# EAGLE design BLEKit v1.2 (EAGLE 7.6.0)
DOCUMENT_NUMBER: 123
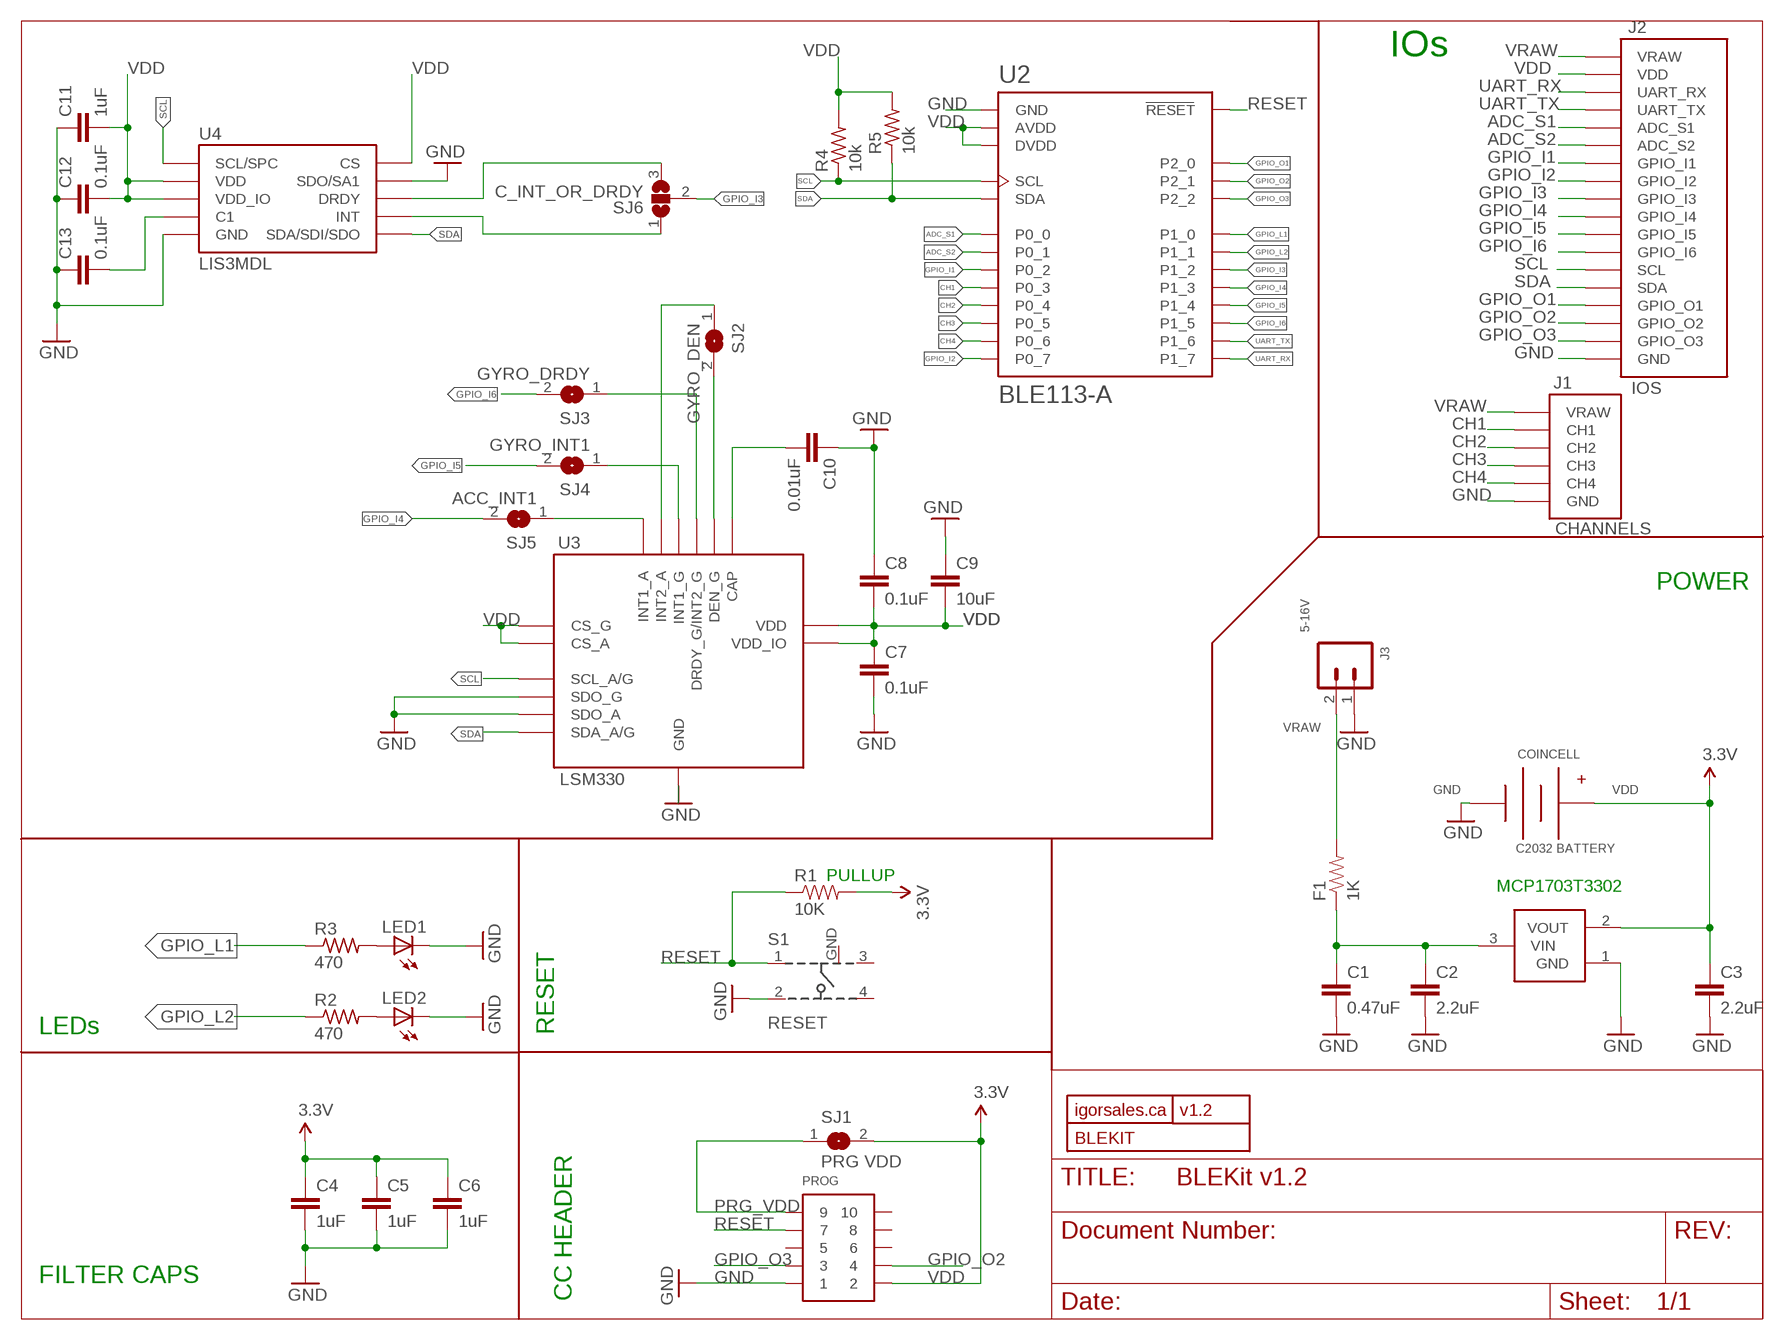
[diagram p0: schematic, sheet 1]

## Parts
BLEKIT  v1.2  IGORSALES_LOGO  [IGORSALES_LOGO]
C1  0.47uF  CAP0603-CAP  [0603-CAP]
C2  2.2uF  CAP0603-CAP  [0603-CAP]
C3  2.2uF  CAP0603-CAP  [0603-CAP]
C4  1uF  CAP0603-CAP  [0603-CAP]
C5  1uF  CAP0603-CAP  [0603-CAP]
C6  1uF  CAP0603-CAP  [0603-CAP]
C7  0.1uF  CAP0603-CAP  [0603-CAP]
C8  0.1uF  CAP0603-CAP  [0603-CAP]
C9  10uF  CAP0603-CAP  [0603-CAP]
C10  0.01uF  CC0402  [C0402]
C11  1uF  CAP0603-CAP  [0603-CAP]
C12  0.1uF  CAP0603-CAP  [0603-CAP]
C13  0.1uF  CAP0603-CAP  [0603-CAP]
COINCELL  C2032 BATTERY  BK-912-TR  [BK-912]
F1  1K  RESISTOR0805-RES  [0805]
J1  CHANNELS  RCTRL_CONNECTOR_CHANNELSRCTRL_CHANNELS_MINI  [HEADER3X4-2.54MM]
J2  IOS  RCTRL_CONNECTOR_IOS-2X9  [HEADER2X9-254MM]
J3  5-16V  CON-S2B-PH-SM4-TB  [S2B-PH-SM4-TB]
LED1  LEDCHIPLED_0805  [CHIPLED_0805]
LED2  LEDCHIPLED_0805  [CHIPLED_0805]
PROG  CONN_5-2-FTSH-V  [FTSH-105-DV]
R1  10K  RESISTOR0603-RES  [0603-RES]
R2  470  R-US_R0603  [R0603]
R3  470  R-US_R0603  [R0603]
R4  10k  R-US_R0402  [R0402]
R5  10k  R-US_R0402  [R0402]
S1  RESET  101-IG  [101-IG]
SJ1  PRG VDD  SJ  [SJ]
SJ2  GYRO_DEN  SJ  [SJ]
SJ3  GYRO_DRDY  SJ  [SJ]
SJ4  GYRO_INT1  SJ  [SJ]
SJ5  ACC_INT1  SJ  [SJ]
SJ6  C_INT_OR_DRDY  SJ2W  [SJ_2]
U1  MCP1703  MCP1703-SOT-23A  [SOT-23A]
U2  BLE113-A  [BLE113-A]
U3  LSM330  [LGA-24-3.5X3X1MM]
U4  LIS3MDL  [VFLGA-2X2X1-12LD]

## Nets
ADC_S1: J2.7(ADC_S1) U2.P0_0
ADC_S2: J2.16(ADC_S2) U2.P0_1
CH1: J1.9(CH1) U2.P0_3
CH2: J1.10(CH2) U2.P0_4
CH3: J1.11(CH3) U2.P0_5
CH4: J1.12(CH4) U2.P0_6
GND [power]: C1.2 C2.2 C3.2 C4.2 C5.2 C6.2 C7.2 C8.1 C9.1 C10.1 C11.1 C12.1 C13.1 COINCELL.BATT-(-) J1.1(GND) J1.2(GND) J1.3(GND) J1.4(GND) J2.1(GND) J3.1 LED1.C LED2.C PROG.1 S1.2 U1.1(GND) U2.GND U2.GND@2(GND) U2.GND@3(GND) U2.GND@4(GND) U2.GND@5(GND) U2.GND@6(GND) U2.GND@7(GND) U2.GND@8(GND) U2.GND@9(GND) U2.GND@10(GND) U3.5(SDO_G) U3.6(SDO_A) U3.14(GND) U3.15(GND) U3.16(GND) U3.17(GND) U3.18(GND) U3.19(GND) U3.20(GND) U4.2(GND) U4.3(GND) U4.9(SDO/SA1) U4.12(GND)
GPIO_I1: J2.4(GPIO_I1) U2.P0_2
GPIO_I2: J2.13(GPIO_I2) U2.P0_7
GPIO_I3: J2.5(GPIO_I3) SJ6.2 U2.P1_2
GPIO_I4: J2.14(GPIO_I4) SJ5.2 U2.P1_3
GPIO_I5: J2.6(GPIO_I5) SJ4.2 U2.P1_4
GPIO_I6: J2.15(GPIO_I6) SJ3.2 U2.P1_5
GPIO_L1: R3.1 U2.P1_0
GPIO_L2: R2.1 U2.P1_1
GPIO_O1: J2.11(GPIO_O1) U2.P2_0
GPIO_O2: J2.3(GPIO_O2) PROG.4 U2.P2_1
GPIO_O3: J2.12(GPIO_O3) PROG.3 U2.P2_2
N$1: LED2.A R2.2
N$2: SJ2.2 U3.13(DEN_G)
N$3: SJ2.1 U3.12(INT2_A)
N$4: LED1.A R3.2
N$5: C10.2 U3.21(CAP)
N$6: C13.2 U4.4(C1)
N$7: SJ5.1 U3.11(INT1_A)
N$8: SJ3.1 U3.9(DRDY_G/INT2_G)
N$9: SJ6.3 U4.8(DRDY)
N$10: SJ4.1 U3.10(INT1_G)
N$13: SJ6.1 U4.7(INT)
PRG_VDD [power]: PROG.9 SJ1.1
RESET: PROG.7 R1.1 S1.1 U2.RESET
SCL: J2.9(SCL) R4.1 U2.SCL U3.2(SCL_A/G) U4.1(SCL/SPC)
SDA: J2.18(SDA) R5.1 U2.SDA U3.4(SDA_A/G) U4.11(SDA/SDI/SDO)
UART_RX: J2.8(UART_RX) U2.P1_7
UART_TX: J2.17(UART_TX) U2.P1_6
VDD [power]: C3.1 C4.1 C5.1 C6.1 C7.1 C8.2 C9.2 C11.2 C12.2 COINCELL.BATT+(+) COINCELL.BATT+@2(+) J2.2(VDD) PROG.2 R1.2 R4.2 R5.2 SJ1.2 U1.2(VOUT) U2.AVDD U2.DVDD U3.1(VDD_IO) U3.3(VDD_IO) U3.7(CS_G) U3.8(CS_A) U3.22(VDD) U3.23(VDD) U3.24(VDD) U4.5(VDD) U4.6(VDD_IO) U4.10(CS) ; supply symbol labelled 3.3V
VRAW: F1.2 J1.5(VRAW) J1.6(VRAW) J1.7(VRAW) J1.8(VRAW) J2.10(VRAW) J3.2
VRAW_FILTERED [power]: C1.1 C2.1 F1.1 U1.3(VIN)
Unconnected: J3.MNT$1 J3.MNT$2 PROG.5 PROG.6 PROG.8 PROG.10 S1.3 S1.4

## Notes on the sheet
- IOs
- POWER
- PULLUP
- MCP1703T3302
- LEDs | RESET
- FILTER CAPS
- CC HEADER

## Power pins joined to a net without a drawn wire
GND: S1.GND

## Library data of the parts
BLEKIT = igorsales:IGORSALES_LOGO: igorsales.ca logo
C1 = SparkFun:CAP: Capacitor Standard 0603 ceramic capacitor, and 0.1" leaded capacitor.; MOUSER#: 81-GRM188R60J474KA01; MPN: GRM188R60J474KA01
C2 C3 = SparkFun:CAP: Capacitor Standard 0603 ceramic capacitor, and 0.1" leaded capacitor.; MOUSER#: 81-GRM188R61A225KE4J; MPN: GRM188R61A225KE4J
C4-C6 C11 = SparkFun:CAP: Capacitor Standard 0603 ceramic capacitor, and 0.1" leaded capacitor.; MOUSER#: 81-GRM188R61C105KA3J; MPN: GRM188R61C105KA93J
C7 C8 C12 C13 = SparkFun:CAP: Capacitor Standard 0603 ceramic capacitor, and 0.1" leaded capacitor.; MOUSER#: 81-GRM39X104K16; MPN: GRM188R71C104KA01D
C9 = SparkFun:CAP: Capacitor Standard 0603 ceramic capacitor, and 0.1" leaded capacitor.; MOUSER#: 963-EMK107BBJ106MA-T; MPN: EMK107BBJ106MA-T
C10 = eagle-ltspice:C: CAPACITOR, European symbol; MOUSER#: 81-GRM36X103K25; MPN: GRM155R71E103KA01D; SPICEMODEL: NONE; SPICEPREFIX: C; VOLTAGE: 25V
COINCELL = igorsales:BK-912-TR: Coin Cell Battery Holder, bottom surface mouted for C2032 batteries; DIGI-KEY#: BK-912-ND; MPN: BK-912
F1 = SparkFun:RESISTOR: Resistor Basic schematic elements and footprints for 0603, 1206, and PTH resistors.; MOUSER#: 810-MMZ2012R102A; MPN: MMZ2012R102A
J1 = igorsales:RCTRL_CONNECTOR_CHANNELS: Header to connect pins. 2.54MM pitch, with 5mm exposed lead upwards.; DIGI-KEY#: TSW-104-07-T-T-ND; MPN: TSW-104-07-T-T
J2 = igorsales:RCTRL_CONNECTOR_IOS: RCTRL's 3X6 HEADER with 2.54mm pitch and 5mm lead size; MOUSER#: 649-77313-401-18LF; MPN: 77313-401-18LF
J3 = PowerBoard:CON-S2B-PH-SM4-TB: JST connector (vertical) 2-pin vertical JST connector with SMT Source: http://www.jst-mfg.com/product/pdf/eng/ePH.pdf; CONNECTOR-TYPE: Header, shrouded; CONTACT-TYPE: Male pin; DIGI-KEY#: 455-1749-1-ND; MF: JST; MPN: S2B-PH-SM4-TB(LF)(SN)
LED1 = led:LED: LED OSRAM: - CHIPLED LG R971, LG N971, LY N971, LG Q971, LY Q971, LO R971, LY R971 LH N974, LH R974 LS Q976, LO Q976, LY Q976 LO Q996 - Hyper CHIPLED LW Q18S LB Q993, LB Q99A, LB R99A - SideLED LS A670, LO A670, LY A670, LG A670, LP A670 LB A673, LV A673, LT A673, LW A673 LH A674 LY A675 LS A676, LA A676, LO A676, LY A676, LW A676 LS A679, LY A679, LG A679 - Hyper Micro SIDELED® LS Y876, LA Y876, LO Y876, LY Y876 LT Y87S - SmartLED LW L88C, LW L88S LB L89C, LB L89S, LG L890 LS L89K, LO L89K, LY L89K LS L896, LA L896, LO L896, LY L896 - TOPLED LS T670, LO T670, LY T670, LG T670, LP T670 LSG T670, LSP T670, LSY T670, LOP T670, LYG T670 LG T671, LOG T671, LSG T671 LB T673, LV T673, LT T673, LW T673 LH T674 LS T676, LA T676, LO T676, LY T676, LB T676, LH T676, LSB T676, LW T676 LB T67C, LV T67C, LT T67C, LS T67K, LO T67K, LY T67K, LW E67C LS E67B, LA E67B, LO E67B, LY E67B, LB E67C, LV E67C, LT E67C LW T67C LS T679, LY T679, LG T679 LS T770, LO T770, LY T770, LG T770, LP T770 LB T773, LV T773, LT T773, LW T773 LH T774 LS E675, LA E675, LY E675, LS T675 LS T776, LA T776, LO T776, LY T776, LB T776 LHGB T686 LT T68C, LB T68C - Hyper Mini TOPLED® LB M676 - Mini TOPLED Santana® LG M470 LS M47K, LO M47K, LY M47K Source: http://www.osram.convergy.de LUXEON: - LUMILED® LXK2-PW12-R00, LXK2-PW12-S00, LXK2-PW14-U00, LXK2-PW14-V00 LXK2-PM12-R00, LXK2-PM12-S00, LXK2-PM14-U00 LXK2-PE12-Q00, LXK2-PE12-R00, LXK2-PE12-S00, LXK2-PE14-T00, LXK2-PE14-U00 LXK2-PB12-K00, LXK2-PB12-L00, LXK2-PB12-M00, LXK2-PB14-N00, LXK2-PB14-P00, LXK2-PB14-Q00 LXK2-PR12-L00, LXK2-PR12-M00, LXK2-PR14-Q00, LXK2-PR14-R00 LXK2-PD12-Q00, LXK2-PD12-R00, LXK2-PD12-S00 LXK2-PH12-R00, LXK2-PH12-S00 LXK2-PL12-P00, LXK2-PL12-Q00, LXK2-PL12-R00 Source: www.luxeon.com KINGBRIGHT: KA-3528ASYC Source: www.kingbright.com; MOUSER#: 638-1721SYGCS530E2; MPN: 1721SYGCS530E2
LED2 = led:LED: LED OSRAM: - CHIPLED LG R971, LG N971, LY N971, LG Q971, LY Q971, LO R971, LY R971 LH N974, LH R974 LS Q976, LO Q976, LY Q976 LO Q996 - Hyper CHIPLED LW Q18S LB Q993, LB Q99A, LB R99A - SideLED LS A670, LO A670, LY A670, LG A670, LP A670 LB A673, LV A673, LT A673, LW A673 LH A674 LY A675 LS A676, LA A676, LO A676, LY A676, LW A676 LS A679, LY A679, LG A679 - Hyper Micro SIDELED® LS Y876, LA Y876, LO Y876, LY Y876 LT Y87S - SmartLED LW L88C, LW L88S LB L89C, LB L89S, LG L890 LS L89K, LO L89K, LY L89K LS L896, LA L896, LO L896, LY L896 - TOPLED LS T670, LO T670, LY T670, LG T670, LP T670 LSG T670, LSP T670, LSY T670, LOP T670, LYG T670 LG T671, LOG T671, LSG T671 LB T673, LV T673, LT T673, LW T673 LH T674 LS T676, LA T676, LO T676, LY T676, LB T676, LH T676, LSB T676, LW T676 LB T67C, LV T67C, LT T67C, LS T67K, LO T67K, LY T67K, LW E67C LS E67B, LA E67B, LO E67B, LY E67B, LB E67C, LV E67C, LT E67C LW T67C LS T679, LY T679, LG T679 LS T770, LO T770, LY T770, LG T770, LP T770 LB T773, LV T773, LT T773, LW T773 LH T774 LS E675, LA E675, LY E675, LS T675 LS T776, LA T776, LO T776, LY T776, LB T776 LHGB T686 LT T68C, LB T68C - Hyper Mini TOPLED® LB M676 - Mini TOPLED Santana® LG M470 LS M47K, LO M47K, LY M47K Source: http://www.osram.convergy.de LUXEON: - LUMILED® LXK2-PW12-R00, LXK2-PW12-S00, LXK2-PW14-U00, LXK2-PW14-V00 LXK2-PM12-R00, LXK2-PM12-S00, LXK2-PM14-U00 LXK2-PE12-Q00, LXK2-PE12-R00, LXK2-PE12-S00, LXK2-PE14-T00, LXK2-PE14-U00 LXK2-PB12-K00, LXK2-PB12-L00, LXK2-PB12-M00, LXK2-PB14-N00, LXK2-PB14-P00, LXK2-PB14-Q00 LXK2-PR12-L00, LXK2-PR12-M00, LXK2-PR14-Q00, LXK2-PR14-R00 LXK2-PD12-Q00, LXK2-PD12-R00, LXK2-PD12-S00 LXK2-PH12-R00, LXK2-PH12-S00 LXK2-PL12-P00, LXK2-PL12-Q00, LXK2-PL12-R00 Source: www.luxeon.com KINGBRIGHT: KA-3528ASYC Source: www.kingbright.com; MOUSER#: 638-172BHC-AN1P23T; MPN: 172BHC-AN1P23T
PROG = pel_misc:CONN_5-2; DIGI-KEY#: FTSH-105-02-F-DV-ND; MOUSER#: 649-202112100010C4LF; MPN: FTSH-105-02-F-DV
R1 = SparkFun:RESISTOR: Resistor Basic schematic elements and footprints for 0603, 1206, and PTH resistors.; MOUSER#: 603-AF0603FR-0710KL; MPN: AF0603FR-0710KL
R2 R3 = resistor:R-US_: RESISTOR, American symbol; MOUSER#: 667-ERJ-3EKF4700V; MPN: ERJ-3EKF4700V
R4 R5 = rcl:R-US_: RESISTOR, American symbol; MOUSER#: 603-AF0603FR-0710KL; MPN: AF0603FR-0710KL; POWER: 0.063W; VOLTAGE: 50V
S1 = sf-keyglove:101-IG; MOUSER#: 101-IG23K-EV; MPN: 101-IG23K-EV
SJ1-SJ5 = jumper:SJ: SMD solder JUMPER
SJ6 = jumper:SJ2W: SMD solder JUMPER
U1 = igorsales:MCP1703-SOT-23A: MCP1703 SOT-23A; DIGI-KEY#: MCP1703T-3302E/CBCT-ND; MOUSER#: 579-MCP1703T-3302ECB; MPN: MCP1703T-3302E/CB
U2 = sf-bluegiga:BLE113: Bluetooth Low Energy single-mode module - Bluetooth 4.0 (CC2541). BLE113-A variant has an on-module ceramic chip antenna. BLE113-A variant includes keepout/restrict area. Antenna edge of the module should be flush up against the edge of the PCB. See datasheet for variant layout details. The BLE113 is a Bluetooth Smart module targeted for small and low-power sensors and accessories. It integrates all features required for a Bluetooth Smart application, including Bluetooth radio, software stack, and GATT-based profiles. The BLE113 Bluetooth Smart module can also host end-user applications, which means no external micro controller is required in size or price constrained devices. Moreover, it has flexible hardware interfaces to connect to different peripherals and sensors and can be powered directly from a standard 3V coin cell battery or a pair of AAA batteries. In the lowest power sleep mode it merely consumes 500 nA and will wake up within a few hundred microseconds. The BLE113 Bluetooth Smart module conusmer approximately 30% less power and is smaller than the BLE112 Bluetooth Smart Module. http://www.bluegiga.com/en-US/products/bluetooth-4.0-modules/ble113-bluetooth--smart-module https://github.com/jrowberg/sf-oshw Last updated 2014-01-04 by Jeff Rowberg <jeff@rowberg.net>; ANTENNA: On-module ceramic chip antenna; DIGI-KEY#: 1446-1035-1-ND; MOUSER#: 603-BLE113-A-M256K; MPN: BLE113-A-M256K
U3 = igorsales:LSM330: LSM330 http://www.st.com/web/en/resource/technical/document/datasheet/DM00059856.pdf; I2C_ADDR: 0x3C,0xD4; MOUSER#: 511-LSM330TR; MPN: LSM330TR
U4 = igorsales:LIS3MDL: Compass IC http://www.st.com/web/en/resource/technical/document/datasheet/DM00075867.pdf; I2C_ADDR: 0x38; MOUSER#: 511-LIS3MDLTR; MPN: LIS3MDLTR

## Net classes
0 default: width 0.152 mm, drill 0.33 mm, clearance 0.152 mm
1 power: width 0.254 mm, drill 0.33 mm, clearance 0.152 mm

## Board
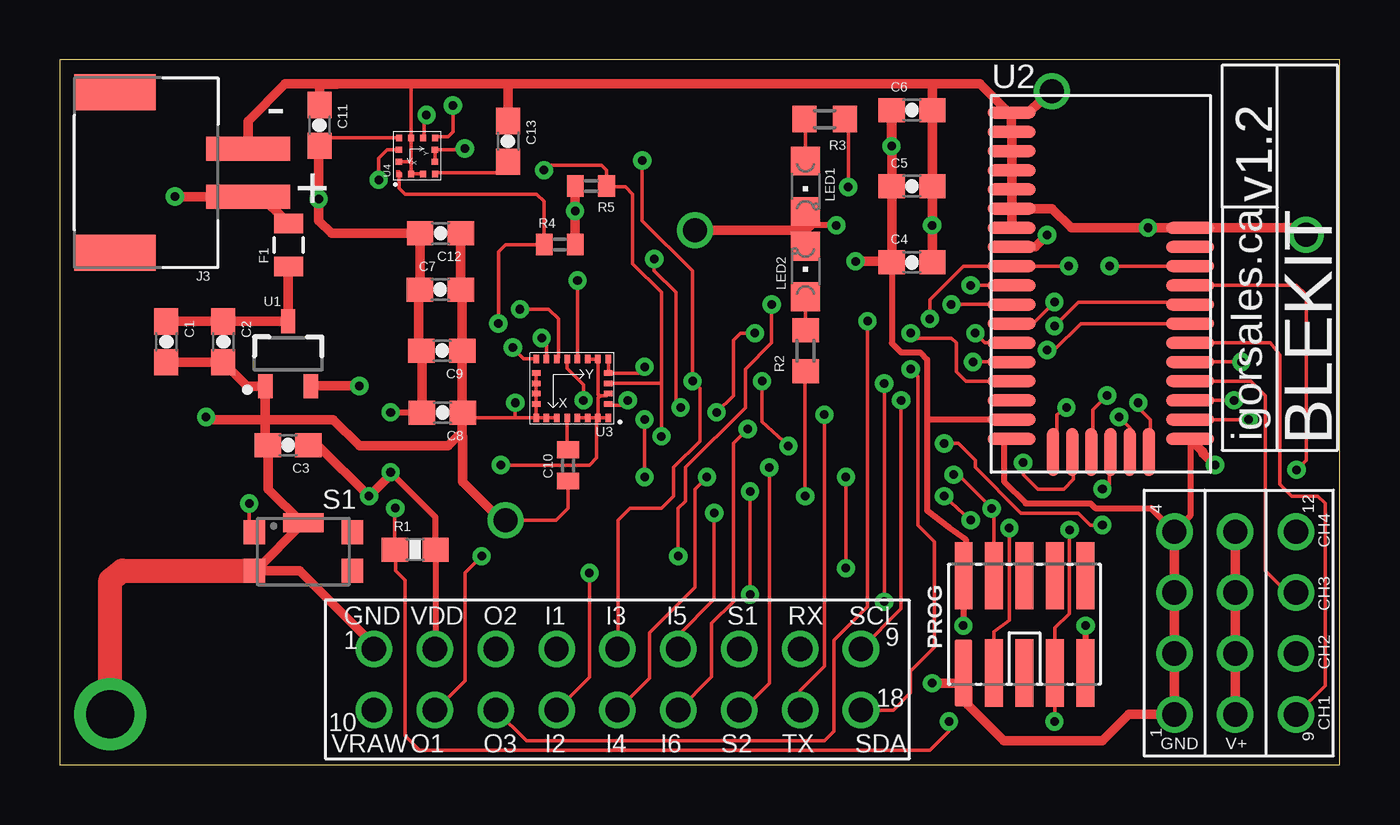
[diagram p1: board, top side]
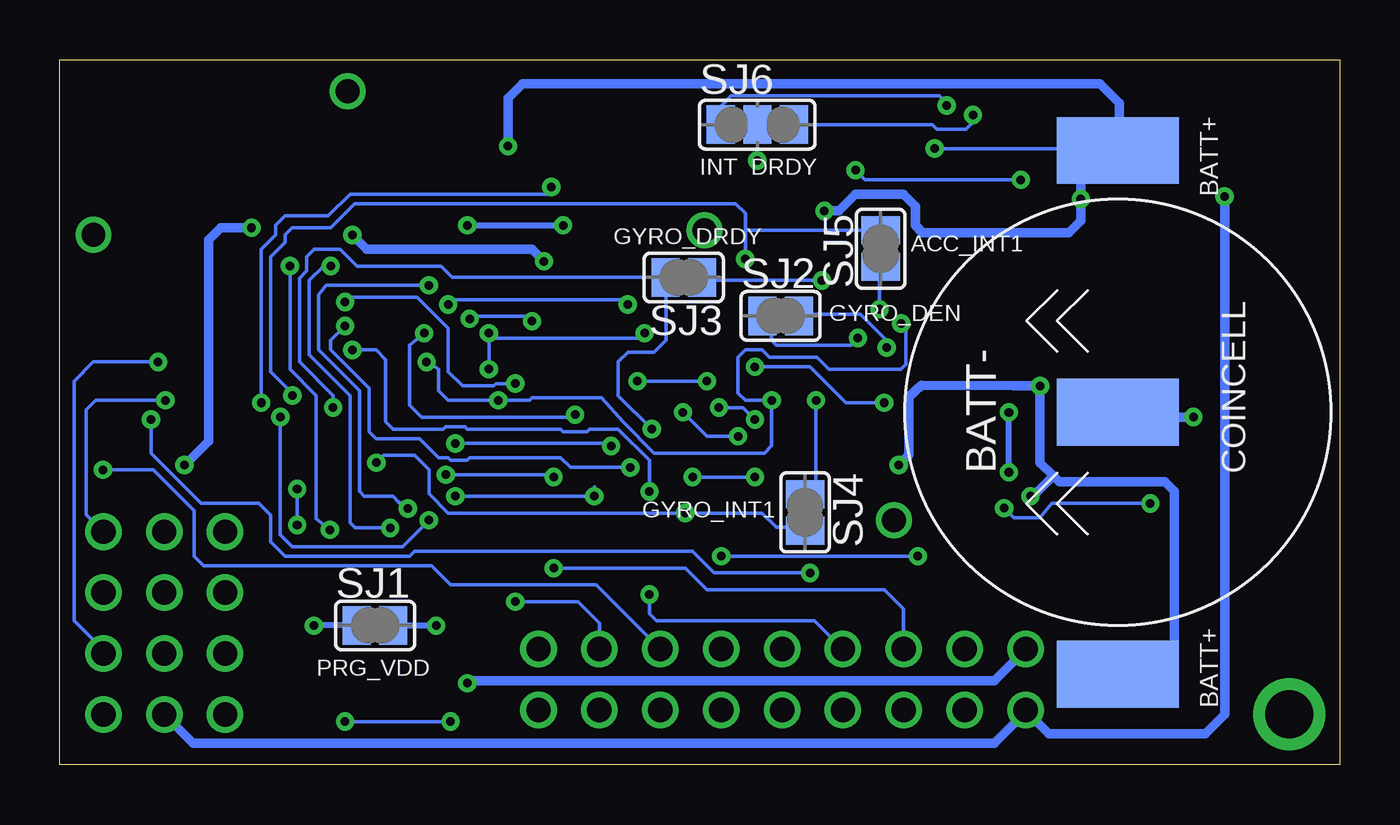
[diagram p2: board, bottom side, seen from below]

Size 53.4 x 29.4 mm. Coordinates in mm from the lower left corner, seen from the top.
Outline: 0,0 53.4,0 53.4,29.4 0,29.4 0,0
Copper layers (1*16): Top 0.0178mm / dielectric 59mil / Bottom 0.0178mm
Design rules "SSC-EAGLE-2Lyr_v1.0.0.3": minimum track width 6mil, minimum drill 14mil, track to track 6mil, track to pad 6mil, pad to pad 6mil, via to via 6mil, smd to smd 6mil, copper to edge 20mil, drill to drill 16mil, minimum pad ring 8mil, minimum via ring 8mil, stop-mask expansion 3mil, vias tented up to drill 0mil, thermal gap 10mil

### Footprints (pad centres in the part's own frame; a part is rotated, then mirrored left to right if it is on the bottom)
0603-CAP = smd 1.1 x 1: 1 -0.85,0; 2 0.85,0
C0402 = smd 0.7 x 0.9: 1 -0.65,0; 2 0.65,0
BK-912 = smd 2.794 x 5.08 bottom: BATT+ -10.922,0; BATT+@2 10.922,0; BATT- 0,0
0805 = smd 0.8 x 1.2: 1 -0.9,0; 2 0.9,0
HEADER3X4-2.54MM = drill 1.016: 1 -3.81,2.54; 2 -1.27,2.54; 3 1.27,2.54; 4 3.81,2.54; 5 -3.81,0; 6 -1.27,0; 7 1.27,0; 8 3.81,0; 9 -3.81,-2.54; 10 -1.27,-2.54; 11 1.27,-2.54; 12 3.81,-2.54
HEADER2X9-254MM = drill 1.016: 1 -10.16,1.27; 2 -7.62,1.27; 3 -5.08,1.27; 4 -2.54,1.27; 5 0,1.27; 6 2.54,1.27; 7 5.08,1.27; 8 7.62,1.27; 9 10.16,1.27; 10 -10.16,-1.27; 11 -7.62,-1.27; 12 -5.08,-1.27; 13 -2.54,-1.27; 14 0,-1.27; 15 2.54,-1.27; 16 5.08,-1.27; 17 7.62,-1.27; 18 10.16,-1.27
S2B-PH-SM4-TB = smd 1 x 3.5: 1 1,-2.75; 2 -1,-2.75 | smd 1.5 x 3.4: MNT$1 3.35,2.8; MNT$2 -3.35,2.8
CHIPLED_0805 = smd 1.2 x 1.2: A 0,-1.05; C 0,1.05
FTSH-105-DV = smd 0.74 x 2.8: 1 -2.54,-2.03; 2 -2.54,2.03; 3 -1.27,-2.03; 4 -1.27,2.03; 5 0,-2.03; 6 0,2.03; 7 1.27,-2.03; 8 1.27,2.03; 9 2.54,-2.03; 10 2.54,2.03
0603-RES = smd 1.1 x 1: 1 -0.85,0; 2 0.85,0
R0603 = smd 1 x 1.1: 1 -0.85,0; 2 0.85,0
R0402 = smd 0.7 x 0.9: 1 -0.65,0; 2 0.65,0
101-IG = smd 0.9 x 1: 1 -2.05,0.8; 2 -2.05,-0.8; 3 2.05,0.8; 4 2.05,-0.8 | smd 1.7 x 0.8: GND 0,1.2
SJ = smd 1.168 x 1.6: 1 -0.762,0; 2 0.762,0
SJ_2 = smd 1.168 x 1.6: 1 -1.524,0; 2 0,0; 3 1.524,0
SOT-23A = smd 0.6 x 1: 1 -0.95,-1.35; 2 0.95,-1.35; 3 0,1.35
BLE113-A = smd 2 x 0.5: AVDD -3.725,1.538; DVDD -3.725,-5.662; GND -3.725,7.138; GND@2 -3.725,6.338; GND@3 -3.725,5.537; GND@4 -3.725,4.737; GND@5 -3.725,3.938; GND@6 -3.725,3.138; GND@7 -3.725,2.337; GND@8 -3.725,-6.463; GND@9 3.725,-6.463; GND@10 3.725,2.337; NC -3.725,-4.862; NC@2 3.725,1.538; P0_0 3.725,-0.062; P0_1 3.725,-0.863; P0_2 3.725,-1.663; P0_3 3.725,-2.462; P0_4 3.725,-3.263; P0_5 3.725,-4.062; P0_6 3.725,-4.862; P0_7 3.725,-5.662; P1_6 -3.725,-2.462; P1_7 -3.725,-1.663; P2_0 -3.725,-0.863; P2_1 -3.725,-0.062; P2_2 -3.725,0.738; RESET 3.725,0.738; SCL -3.725,-3.263; SDA -3.725,-4.062 | smd 0.5 x 2: P1_0 2,-7.013; P1_1 1.2,-7.013; P1_2 0.4,-7.013; P1_3 -0.4,-7.013; P1_4 -1.2,-7.013; P1_5 -2,-7.013
LGA-24-3.5X3X1MM = smd 0.23 x 0.35: 1 -1.505,1.225; 6 -1.505,-1.225; 7 -1.075,-1.225; 8 -0.645,-1.225; 9 -0.215,-1.225; 10 0.215,-1.225; 11 0.645,-1.225; 12 1.075,-1.225; 13 1.505,-1.225; 18 1.505,1.225; 19 1.075,1.225; 20 0.645,1.225; 21 0.215,1.225; 22 -0.215,1.225; 23 -0.645,1.225; 24 -1.075,1.225 | smd 0.35 x 0.23: 2 -1.505,0.645; 3 -1.505,0.215; 4 -1.505,-0.215; 5 -1.505,-0.645; 14 1.505,-0.645; 15 1.505,-0.215; 16 1.505,0.215; 17 1.505,0.645
VFLGA-2X2X1-12LD = smd 0.2 x 0.2: 1 -0.775,0.75 | smd 0.275 x 0.25: 2 -0.75,0.25; 3 -0.75,-0.25; 4 -0.75,-0.75; 7 0.75,-0.75; 8 0.75,-0.25; 9 0.75,0.25; 10 0.75,0.75 | smd 0.25 x 0.275: 5 -0.25,-0.75; 6 0.25,-0.75; 11 0.25,0.75; 12 -0.25,0.75

### Placement (x,y rotation side)
BLEKIT  50.81,21.18 90 top
C1  4.44,17.64 270 top
C2  6.82,17.64 270 top
C3  9.53,13.34 180 top
C4  35.56,20.95 0 top
C5  35.56,24.13 0 top
C6  35.56,27.3 0 top
C7  15.88,19.82 0 top
C8  15.96,14.69 180 top
C9  15.94,17.27 180 top
C10  21.2,12.48 90 top
C11  10.83,26.67 270 top
C12  15.88,22.17 180 top
C13  18.7,26 270 top
COINCELL  9.26,14.7 270 top
F1  9.54,21.68 90 top
J1  49.05,5.91 90 top
J2  23.27,3.55 0 top
J3  5.1,24.7 90 top
LED1  31.11,24.13 180 top
LED2  31.11,20.57 0 top
PROG  40.25,5.86 0 top
R1  14.82,8.97 0 top
R2  31.11,17.27 90 top
R3  31.91,26.93 180 top
R4  20.86,21.7 0 top
R5  22.16,24.14 180 top
S1  10.16,8.89 0 top
SJ1  40.25,5.81 0 bottom
SJ2  23.32,18.73 0 bottom
SJ3  27.37,20.32 180 bottom
SJ4  22.3,10.53 270 bottom
SJ5  19.15,21.52 90 bottom
SJ6  24.3,26.7 0 bottom
U1  9.53,17.14 0 top
U2  43.44,20.06 0 top
U3  21.38,15.69 180 top
U4  14.9,25.4 90 top

### Tracks (layer width: path | path; a pad name or v marks a point on that pad's centre or on a via)
ADC_S1  (via drill 0.36)
  Top 0.152: U2.P0_0 51.6,20 52,19.6 52,12.7 v51.6,12.3
  Bottom 0.152: v51.6,12.3 49.5,12.3 47.8,10.6 47.8,8.7 47.4,8.3 37.9,8.3 37.1,7.5 31.02,7.5 J2.7
ADC_S2  (via drill 0.36)
  Top 0.152: J2.16 28.48,2.28 29.6,3.4 v29.6,12.4 | v41.5,18.3 42.5,19.3 47.06,19.3 U2.P0_1
  Bottom 0.152: v29.6,12.4 32.1,12.4 32.5,12.8 36.3,12.8 36.4,12.7 37.1,12.7 37.2,12.8 37.6,12.8 38.4,13.6 40.2,13.6 40.5,13.9 40.5,15.7 42.1,17.3 42.1,17.7 v41.5,18.3
CH1
  Top 0.152: J1.9 52.8,3.3 52.8,10.9 52.5,11.2 51.4,11.2 50.9,11.7 50.9,17.1 50.5,17.6 U2.P0_3
CH2  (via drill 0.36)
  Top 0.152: v49.3,16.8 U2.P0_4
  Bottom 0.152: J1.10 51.59,4.79 52.8,6 52.8,16 52,16.8 v49.3,16.8
CH3
  Top 0.152: J1.11 51.22,7.18 50.3,8.1 50.3,15.4 49.7,16 U2.P0_5
CH4  (via drill 0.36)
  Top 0.152: v49,15.2 U2.P0_6
  Bottom 0.152: v49,15.2 51.9,15.2 52.3,14.8 52.3,10.43 J1.12
GND  (via drill 0.36, 1, 2)
  Top 0.152: 14.6,28.4 14.65,28.35 U4.9 14.65,25.2 | U4.3 U4.2 14.65,25.2 | U4.12 14.6,25.15 14.65,25.2 | U3.6 U3.5 24.14,16.34 v24.4,16.6 | U3.20 U3.19 U3.18 | U3.18 19,14.47 | 19,14.47 17.03,14.47 C8.1 | U3.18 U3.17 U3.16 U3.15 U3.14 | v19,15.1 19,14.47 | C10.1 21.2,10.71 20.7,10.2 v18.6,10.2 | 8.57,13.44 8.57,14.38 8.6,14.4
  Top 0.254: U2.GND@9 47.16,10.38 J1.4 45.52,10.7 43.2,10.7 43,10.9 40.3,10.9 39.41,11.79 39.41,13.48 39.2,13.7 39.61,13.7 U2.GND@8 | 36.41,21.69 v36.4,22.5 | v32.4,22.5 31.41,22.5 31.11,22.2
  Top 0.4: v36.4,3.4 37.58,3.4 37.64,3.46 | 37.64,3.46 PROG.1 | 37.64,3.46 37.9,3.2 37.9,2.5 39.4,1 43.5,1 44.6,2.1 J1.1 J1.2 J1.3 J1.4 | U2.GND@7 U2.GND@6 | U2.GND@6 U2.GND@5 U2.GND@4 U2.GND@3 U2.GND@2 39.72,26.48 39.7,26.5 39.7,27.18 | 39.7,27.18 U2.GND 40.4,27.2 v41.4,28.1 | J2.1 13.11,4.99 10,8.1 S1.2 8.16,8.09 S1.GND 10.11,10.09 8.7,11.5 8.7,13.31 C3.2 8.57,13.44 U1.1 7.81,15.79 C2.2 C1.2 | 36.53,27.18 C6.2 | C6.2 C5.2 36.41,21.69 C4.2 | 16.79,14.71 C9.1 16.79,19.75 C7.2 C12.1 | 16.79,14.71 C8.1 | 16.79,14.71 16.79,13.71 16.8,13.7 | 16.8,13.7 16.6,13.7 16.2,13.3 12.5,13.3 11.4,14.4 8.6,14.4 6.3,14.4 v6.1,14.5 | LED2.C 31.11,22.2 | 31.11,22.2 LED1.C | 45.6,22.4 v45.4,22.4 | v48.2,12.5 47.7,13 47.7,13.06 U2.GND@9 | 45.6,22.4 U2.GND@10 51.5,22.4 51.8,22.1 v52,22.1 | 45.6,22.4 42.2,22.4 41.4,23.2 U2.GND@6 | 39.7,27.18 39.62,27.18 38.4,28.4 36.4,28.4 | 36.4,28.4 18.7,28.4 | 18.7,28.4 14.6,28.4 12.4,28.4 | C6.2 36.41,28.39 36.4,28.4 | v18.6,10.2 18.4,10.2 16.8,11.8 16.8,13.7 | v26.5,22.3 31.02,22.3 31.11,22.2 | J3.1 7.85,26.85 9.4,28.4 12.4,28.4 | C11.1 10.83,28.37 12.4,28.4 | C13.1 18.7,28.4
  Top 1: v2.1,2.1 2.1,7.7 2.6,8.1 S1.2
  Bottom 0.152: v24.4,16.6 22.1,16.6 20.6,15.1 v19,15.1 | 8.9,14.7 8.78,14.7 8.57,14.5
  Bottom 0.254: v36.4,22.5 v32.4,22.5
  Bottom 0.4: J2.1 13.11,4.79 14.4,3.5 36.3,3.5 v36.4,3.4 | v6.1,14.5 8.57,14.5 9.05,14.5 COINCELL.BATT- 8.9,14.7 | v45.4,22.4 46.7,22.4 47.2,21.9 47.2,13.5 v48.2,12.5
GPIO_I1  (via drill 0.36)
  Top 0.152: U2.P0_2 42.6,18.4 41.5,17.3 v41.2,17.3 | v28.8,11.4 v28.8,7.1
  Bottom 0.152: v41.2,17.3 40.2,17.3 39.8,16.9 39.8,14.3 39.5,14 37.4,14 37.3,14.1 36.5,14.1 36.4,14 32.5,14 32.4,13.9 31.4,13.9 31.3,14 30.1,14 28.8,12.7 v28.8,11.4 | v28.8,7.1 28.8,6.3 28.5,6 21.9,6 J2.4
GPIO_I2  (via drill 0.36)
  Top 0.152: 46.3,14.4 U2.P0_7 v49.6,14.4 | v22.1,8 22.1,3.66 J2.13
  Bottom 0.152: v49.6,14.4 49.6,13 47.5,10.9 45.1,10.9 44.6,10.4 44.6,9.3 44,8.7 38.8,8.7 38.6,8.9 27,8.9 26.1,8 v22.1,8
GPIO_I3  (via drill 0.36)
  Top 0.152: v24.3,25.2 24.3,22.7 26.4,20.6 v26.4,16 26.7,15.7 26.7,13.5 25.6,12.4 25.6,11.2 25.1,10.7 23.8,10.7 23.3,10.2 23.3,4.86 J2.5 | v29.3,16 29.3,14.3 v30.4,13.3 | v36.9,13.4 37.5,13.4 38.2,12.7 38.2,12.4 40.1,10.5 42.5,10.5 43,10 v43.5,10 | v43.5,11.5 43.8,11.7 43.8,13.01 U2.P1_2
  Bottom 0.152: v26.4,16 v29.3,16 | v43.5,10 v43.5,11.5 | v24.3,25.2 SJ6.2 | v36.9,13.4 30.5,13.4 v30.4,13.3
GPIO_I4  (via drill 0.36)
  Top 0.152: v43.7,15.4 43.1,14.8 43.1,13.11 U2.P1_3 | v24.8,21.1 24.8,20.6 25.7,19.7 25.7,15.1 v25.9,14.9 | v24.4,14.4 v24.4,12 | J2.14 24.6,3.62 24.6,5.5 26.5,7.4 26.5,11.5 v27,12
  Bottom 0.152: v43.7,15.4 43.7,15.5 44.6,16.4 44.6,21.2 44,21.8 44,22.1 43.7,22.4 42.1,22.4 41.1,23.4 25.2,23.4 24.8,23 24.8,22.29 | 24.8,22.29 v24.8,21.1 | v25.9,14.9 24.9,14.9 v24.4,14.4 | v24.4,12 v27,12 | SJ5.2 24.8,22.29
GPIO_I5  (via drill 0.36)
  Top 0.152: v40.2,12.6 40.2,12.1 40.8,11.5 41.9,11.5 42.3,11.9 42.3,12.99 U2.P1_4 | J2.6 25.81,5.41 27.3,6.9 v27.3,10.5
  Bottom 0.152: 22.4,9.7 22.37,9.7 SJ4.2 22.44,9.9 23.5,9.9 24.1,10.5 v27.3,10.5 37.2,10.5 38,11.3 38,12.3 38.6,12.9 39.9,12.9 v40.2,12.6
GPIO_I6  (via drill 0.36)
  Top 0.152: 41.5,13.11 U2.P1_5 41.6,13.21 41.6,14.6 v42,14.9 | J2.15 27.2,3.68 27.2,5.9 28.1,6.8 28.1,13.4 v28.7,14
  Bottom 0.152: v42,14.9 42,15.4 43.4,16.8 43.4,20.3 43.1,20.6 43.1,21.2 42.8,21.5 41.7,21.5 41,20.8 37.5,20.8 37.02,20.32 SJ3.2 28.1,20.29 28.1,17.7 28.6,17.2 29.7,17.2 30.1,16.8 30.1,15.4 v28.7,14
GPIO_L1  (via drill 0.36)
  Top 0.152: v45,15.1 45,14.9 45.5,14.4 45.5,13.11 U2.P1_0 | v32.9,24.1 32.9,26.97 R3.1
  Bottom 0.152: v32.9,24.1 33,23.8 41.3,23.8 42.2,22.9 44,22.9 44.4,22.5 44.4,22.1 45,21.5 v45,15.1
GPIO_L2  (via drill 0.36)
  Top 0.152: U2.P1_1 44.64,14.06 v44.2,14.5 | v38,10.2 v36.9,11.2 | v31.1,11.2 31.1,16.41 R2.1
  Bottom 0.152: v38,10.2 39.1,9.1 43.7,9.1 44.2,9.6 v44.2,14.5 | v36.9,11.2 v31.1,11.2 31.1,11.6
GPIO_O1  (via drill 0.36)
  Top 0.152: J2.11 15.68,2.28 16.9,3.5 16.9,8 v17.6,8.7 | v29.7,19.2 29.7,17.6 28.6,16.5 28.6,14.9 26.1,12.4 26.1,11 25.8,10.7 v25.8,8.7 | v37.2,19.2 U2.P2_0
  Bottom 0.152: v25.8,8.7 v17.6,8.7 | v37.2,19.2 37,19.4 29.9,19.4 v29.7,19.2
GPIO_O2  (via drill 0.36)
  Top 0.152: v38.88,10.69 38.98,10.49 PROG.4 38.98,10.62 37.5,12.1 v37.3,12.1 | U2.P2_1 v38,20 | v32.8,12 v32.8,8.2
  Bottom 0.152: 39,20 v38,20 39.2,20 42.3,20 42.6,19.6 42.6,17.3 40.9,15.6 40.9,11.4 40.7,11.2 39.5,11.2 39.28,10.98 v38.88,10.69 | v37.3,12.1 32.9,12.1 v32.8,12 | J2.3 18.2,4.84 18.2,6.5 19,7.3 26.4,7.3 27.3,8.2 v32.8,8.2
GPIO_O3  (via drill 0.36)
  Top 0.152: v33.7,18.5 33.7,6.6 32.3,5.2 32.3,1.4 31.9,1 19.47,1 J2.12 | PROG.3 38.98,5.55 39.62,6.03 v39.62,9.88 | v42.1,20.8 U2.P2_2 37.7,20.8 36.3,19.4 v36.3,18.6
  Bottom 0.152: v39.62,9.88 41.08,9.88 41.3,10.1 41.3,15.4 43,17.1 43,20.2 42.4,20.8 v42.1,20.8 | v36.3,18.6 36.2,18.7 33.9,18.7 v33.7,18.5
N$1
  Top 0.152: LED2.A R2.2
N$2  (via drill 0.36)
  Top 0.152: U3.13 19.9,16.95 19.36,16.95 v18.9,17.4
  Bottom 0.152: v18.9,17.4 18.9,17.7 20,18.8 22.49,18.8 SJ2.2
N$3  (via drill 0.36)
  Top 0.152: U3.12 20.3,17.6 v20.1,17.8
  Bottom 0.152: SJ2.1 24.09,18.39 23.7,18 23.7,17.7 23.5,17.5 20.4,17.5 v20.1,17.8
N$4
  Top 0.152: LED1.A 31.11,26.88 R3.2
N$5
  Top 0.152: U3.21 21.16,13.18 C10.2
N$6
  Top 0.152: U4.4 15.7,24.7 18.6,24.7 18.7,24.8 C13.2
N$7  (via drill 0.36)
  Top 0.152: v19.2,19 20.4,19 20.8,18.6 20.8,16.98 U3.11
  Bottom 0.152: v19.2,19 19.2,20.71 SJ5.1
N$8  (via drill 0.36)
  Top 0.152: 21.63,20.27 v21.6,20.2 U3.9
  Bottom 0.152: v21.6,20.2 26.58,20.2 SJ3.1
N$9  (via drill 0.36)
  Top 0.152: U4.8 15.2,26.2 15.2,27 v15.3,27.1
  Bottom 0.152: SJ6.3 17,26.7 16.8,26.5 15.6,26.5 15.3,26.8 v15.3,27.1
N$10  (via drill 0.36)
  Top 0.152: U3.10 21.16,16.54 21.86,15.85 v21.85,15.2
  Bottom 0.152: SJ4.1 21.86,11.51 v21.85,15.2
N$13  (via drill 0.36)
  Top 0.152: v16.4,27.5 16.4,26.4 16.2,26.2 15.7,26.2 U4.7
  Bottom 0.152: SJ6.1 25.82,27.48 25.4,27.9 16.7,27.9 16.4,27.6 v16.4,27.5
PRG_VDD  (via drill 0.36)
  Top 0.152: PROG.9
  Top 0.254: v42.8,5.8 PROG.9
  Bottom 0.152: 42.59,5.81 v42.8,5.8
  Bottom 0.254: SJ1.1 42.59,5.81
RESET  (via drill 0.36)
  Top 0.152: v42.13,9.8 42.13,6.3 41.52,5.72 PROG.7 41.52,1.88 v41.5,1.8 | v43.8,20.8 U2.RESET | v14,10.7 13.97,10.68 R1.1 14,8.95 14,8.1 14.4,7.7 14.4,1.2 15,0.6 36.3,0.6 37.1,1.4 v37.1,1.8 | v7.9,10.9 7.9,9.9 S1.1
  Bottom 0.152: v41.5,1.8 v37.1,1.8 | v14,10.7 13.6,10.3 12.5,10.3 12,10.9 v7.9,10.9 | v42.13,9.8 42.7,10.27 42.7,15.4 43.8,16.5 v43.8,20.8
SCL  (via drill 0.36)
  Top 0.152: v18.3,18.4 18.3,21.4 18.6,21.7 R4.1 20.2,23.5 19.9,23.8 14.4,23.8 14.15,24.05 U4.1 | v38.1,16.8 U2.SCL | J2.9 35.1,6.5 v35.1,15.2 | v23.7,15.2 23.5,15 22.93,15 U3.2
  Bottom 0.152: v38.1,16.8 37.9,16.8 37.9,16.7 37.6,16.5 37.6,15.6 37.2,15.2 v35.1,15.2 33.8,15.2 33.7,15.3 30.8,15.3 29.9,14.3 28.6,13 24,13 23.7,13.3 v23.7,15.2 24.8,15.2 25.1,15.5 25.1,17 24.8,17.3 24.1,17.3 23.8,17 21.8,17 21.3,16.5 18.3,16.5 18.1,16.7 18.1,18.2 v18.3,18.4
SDA  (via drill 0.36)
  Top 0.152: 25.1,15.9 25.1,19.7 23.9,20.9 23.9,23.8 23.6,24.1 22.86,24.1 R5.1 22.8,24.16 22.8,24.8 22.6,25 20.4,25 v20.2,24.8 | 25.1,15.9 v25.1,13.7 | J2.18 34.78,2.28 35.5,3 35.5,3.9 36.5,4.9 36.5,9.3 35.8,10 35.8,16.2 v35.5,16.5 | U2.SDA 37.8,16 37.4,16.4 37.4,17.6 37.2,17.8 35.7,17.8 v35.5,18 | v29,18 28.4,18 28.1,17.7 28.1,15.4 v27.4,14.7 27.4,14.8 | 14.1,25.7 U4.11 13.65,25.65 13.3,25.3 v13.3,24.4 | U3.4 25.09,15.91 25.1,15.9
  Bottom 0.152: v35.5,16.5 v35.5,18 35.3,17.8 29.2,17.8 v29,18 | v27.4,14.7 26.4,13.7 v25.1,13.7 | v13.3,24.4 19.8,24.4 v20.2,24.8
UART_RX  (via drill 0.36)
  Top 0.152: U2.P1_7 40.6,18.4 v41.5,19.3 | v34.4,15.9 v34.4,6.8
  Bottom 0.152: v41.5,19.3 41.2,19.5 38.5,19.5 37.2,18.2 37.2,16.4 36.6,15.8 35.3,15.8 35.2,15.9 v34.4,15.9 | v34.4,6.8 31.79,6.8 30.89,5.9 J2.8
UART_TX  (via drill 0.36)
  Top 0.152: J2.17 30.89,3.09 31.9,4.1 v31.9,14.6 | U2.P1_6 38.6,17.6 v38.2,18
  Bottom 0.152: v38.2,18 38.8,17.5 38.8,15 38.3,14.5 32,14.5 v31.9,14.6
VDD  (via drill 0.36)
  Top 0.152: v37.71,5.81 v37.7,5.8 | 14.96,17.4 C9.2 | U4.5 U4.6 16.85,25.65 v16.9,25.7 | U3.22 U3.23 U3.24 | U3.1 U3.24 | U3.24 22.23,14.47 22.46,14.5 22.46,15.3 22.6,15.4 | 22.6,15.4 22.8,15.4 U3.3 | U3.8 U3.7 22.45,16.25 22.46,15.75 22.46,15.44 22.6,15.4 | v18.4,12.5 22.1,12.5 22.4,12.8 22.4,14.41 U3.24 | U4.10 10.76,26.15 C11.2
  Top 0.254: v37.71,5.81 PROG.2 37.8,8.1 37.8,9.4 37.1,9.9 36.2,10.6 36.2,14.4 | J2.2 15.68,4.85 R1.2 15.68,10.32 v13.8,12.2 | v13.8,14.7 C8.2 | 36.2,14.4 36.2,16.9 35.9,17.2 35.1,17.2 34.71,17.59 C4.1 | U2.DVDD 36.2,14.4
  Top 0.4: v12.5,15.8 U1.2 | C3.1 10.77,13.34 v12.9,11.2 13.8,12.1 v13.8,12.2 | C8.2 15.11,17.25 C9.2 | U2.AVDD 40.7,21.6 v41.2,22.1 | v33.2,21 34.66,21 C4.1 C5.1 C6.1 v34.7,25.8 | 14.96,17.4 14.96,19.76 C7.1 C12.2 | v21.5,23.1 R4.2
  Top 0.406: R5.2 v21.5,23.1 | C11.2 10.8,25.79 v10.8,23.6 10.8,22.7 11.33,22.17 C12.2
  Bottom 0.152: 39.78,5.8 SJ1.2 | 11,25.6 11,25 10.8,24.6 | v16.9,25.7 11.5,25.7 10.8,24.7
  Bottom 0.254: v37.7,5.8 39.78,5.8 | v13.8,12.2 v13.8,14.7
  Bottom 0.4: 11.95,12.05 11.7,11.8 7.3,11.8 6.9,11.4 6.9,4.9 7,4.8 8.23,4.8 COINCELL.BATT+@2 | 11.95,12.05 12.5,12.6 v12.5,15.8 13.6,15.8 17.46,15.84 17.97,15.34 17.97,12.93 v18.4,12.5 | v12.9,11.2 12.8,11.2 11.95,12.05 | v33.2,21 33.7,21.5 40.6,21.5 v41.2,22.1 | 11,25.6 9.28,25.6 COINCELL.BATT+ 9.2,25.68 9.2,27.6 10,28.4 34.1,28.4 34.7,27.8 v34.7,25.8 | v21.5,23.1 20.9,23.1 20.2,23.8 18.2,23.8 17.7,23.3 17.7,22.5 17.4,22.2 12.1,22.2
  Bottom 0.406: 11,25.6 11,24.9 | 11,24.9 10.8,24.7 10.8,24.6 | 12.1,22.2 11.3,22.2 10.8,22.7 v10.8,23.6 10.8,24.6 | 11,24.9 11,24.8 10.8,24.6
VRAW  (via drill 0.36)
  Top 0.4: J1.5 J1.6 J1.7 J1.8 | 8.3,23.8 J3.2 v4.8,23.7 | 8.3,23.8 8.32,23.8 F1.2 9.52,22.58 8.3,23.8
  Bottom 0.4: 47.3,0.9 14.4,0.9 13.11,2.19 J2.10 12.12,1.3 5.6,1.3 4.8,2.1 v4.8,23.7
  Bottom 0.406: 47.3,0.9 47.85,0.9 J1.5
VRAW_FILTERED
  Top 0.4: C1.1 C2.1 U1.3 9.53,20.77 F1.1

### Text on the board
tPlace: - | +
bPlace: INT DRDY | GYRO_DRDY | ACC_INT1 | GYRO_DEN | GYRO_INT1 | PRG_VDD